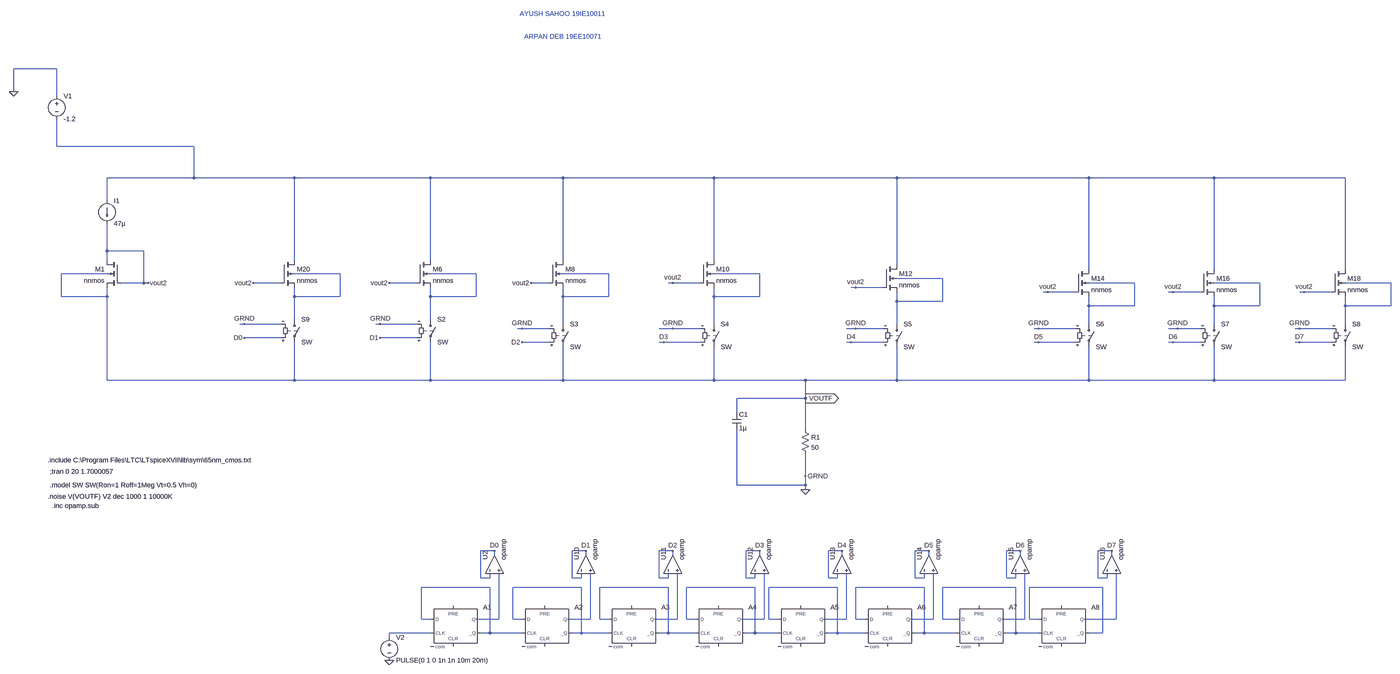
[diagram p0: schematic SIMPLE DAC.asc, whole sheet]
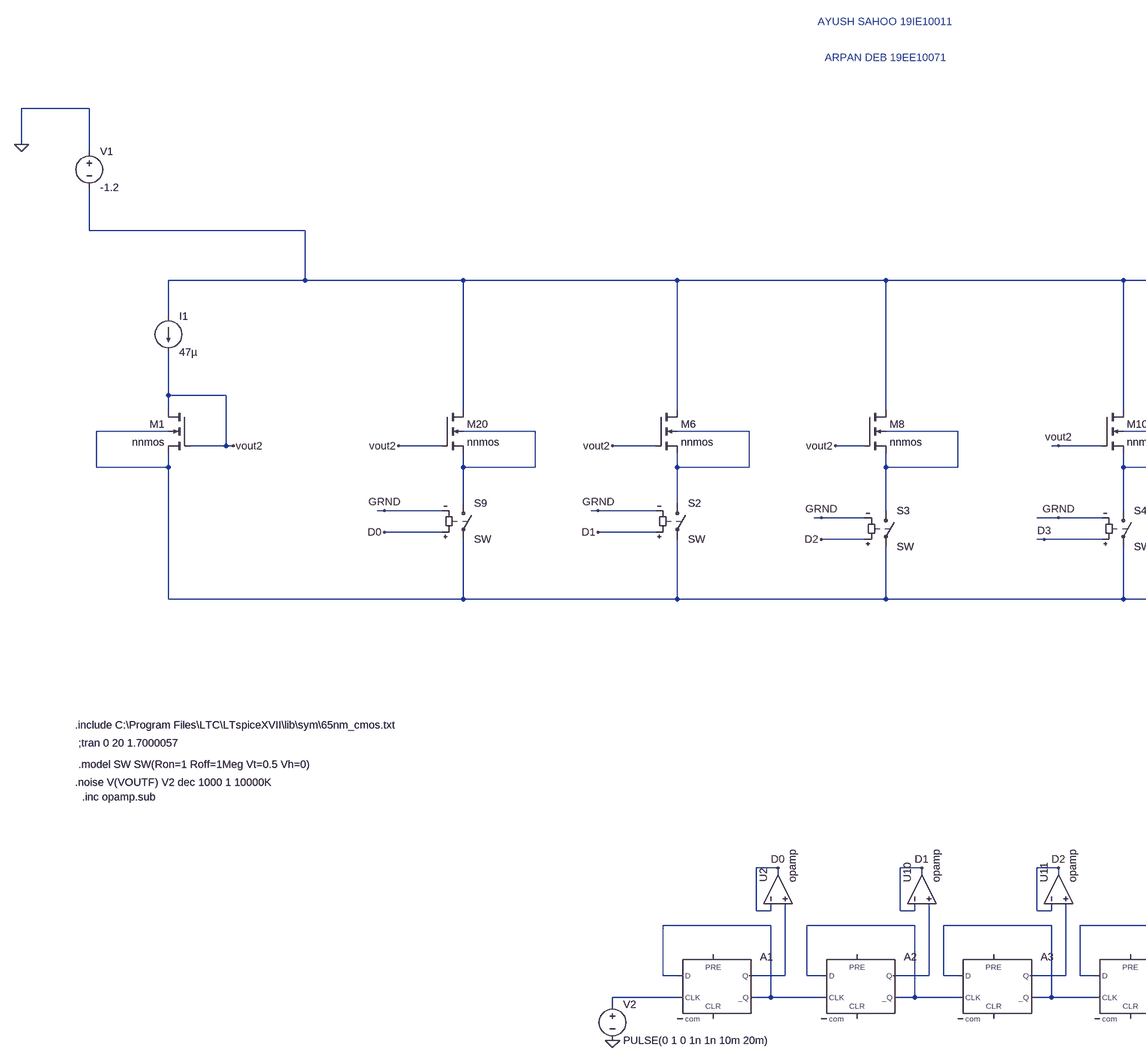
[diagram p1: schematic SIMPLE DAC.asc, part, row 1 of 1, column 1 of 2]
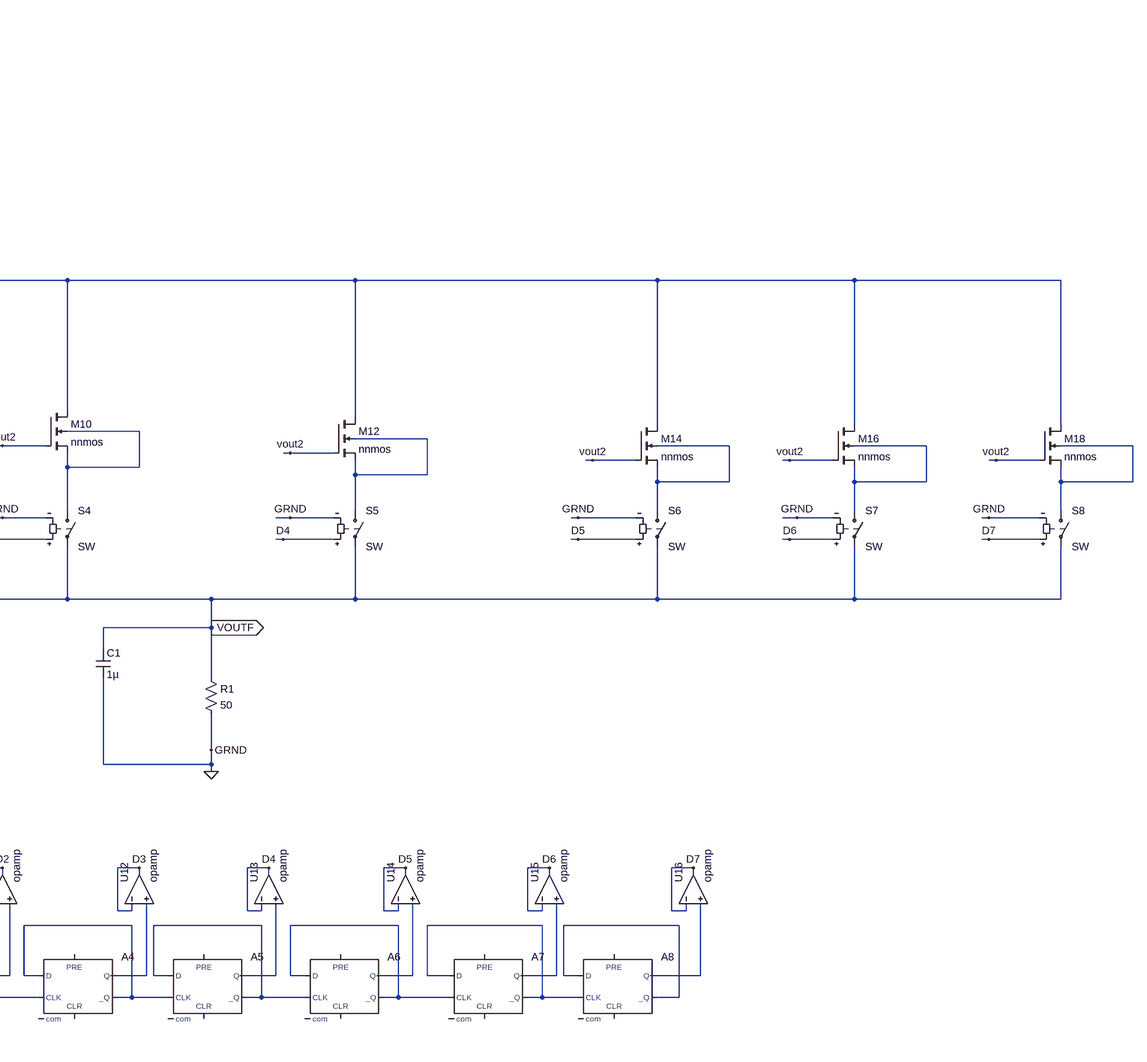
[diagram p2: schematic SIMPLE DAC.asc, part, row 1 of 1, column 2 of 2]
SIMPLE DAC.asc, the LTspice schematic file:
Version 4
SHEET 1 3556 3252
WIRE -1632 432 -2016 432
WIRE -2016 512 -2016 432
WIRE -1632 528 -1632 432
WIRE -1632 704 -1632 608
WIRE -1152 704 -1632 704
WIRE -1152 1168 -1152 704
WIRE -1152 1168 -1456 1168
WIRE -800 1168 -1152 1168
WIRE -256 1168 -800 1168
WIRE 208 1168 -256 1168
WIRE 736 1168 208 1168
WIRE 1376 1168 736 1168
WIRE 2048 1168 1376 1168
WIRE 2768 1168 2048 1168
WIRE 3392 1168 2768 1168
WIRE -1456 1248 -1456 1168
WIRE -1456 1424 -1456 1328
WIRE -1328 1424 -1456 1424
WIRE -1456 1456 -1456 1424
WIRE -800 1456 -800 1168
WIRE -256 1456 -256 1168
WIRE 208 1456 208 1168
WIRE 736 1456 736 1168
WIRE 1376 1472 1376 1168
WIRE 2048 1488 2048 1168
WIRE 2768 1488 2768 1168
WIRE 3392 1488 3392 1168
WIRE -1456 1504 -1616 1504
WIRE -640 1504 -800 1504
WIRE -96 1504 -256 1504
WIRE 368 1504 208 1504
WIRE 896 1504 736 1504
WIRE 1536 1520 1376 1520
WIRE -1328 1536 -1328 1424
WIRE -1328 1536 -1408 1536
WIRE -1312 1536 -1328 1536
WIRE -848 1536 -944 1536
WIRE -304 1536 -400 1536
WIRE 160 1536 96 1536
WIRE 592 1536 576 1536
WIRE 688 1536 592 1536
WIRE 2208 1536 2048 1536
WIRE 2928 1536 2768 1536
WIRE 3552 1536 3392 1536
WIRE 1232 1552 1216 1552
WIRE 1328 1552 1232 1552
WIRE 1904 1568 1888 1568
WIRE 2000 1568 1904 1568
WIRE 2624 1568 2608 1568
WIRE 2720 1568 2624 1568
WIRE 3248 1568 3232 1568
WIRE 3344 1568 3248 1568
WIRE -1616 1584 -1616 1504
WIRE -1456 1584 -1456 1552
WIRE -1456 1584 -1616 1584
WIRE -800 1584 -800 1552
WIRE -640 1584 -640 1504
WIRE -640 1584 -800 1584
WIRE -256 1584 -256 1552
WIRE -96 1584 -96 1504
WIRE -96 1584 -256 1584
WIRE 208 1584 208 1552
WIRE 368 1584 368 1504
WIRE 368 1584 208 1584
WIRE 736 1584 736 1552
WIRE 896 1584 896 1504
WIRE 896 1584 736 1584
WIRE 1376 1600 1376 1568
WIRE 1536 1600 1536 1520
WIRE 1536 1600 1376 1600
WIRE 2048 1616 2048 1584
WIRE 2208 1616 2208 1536
WIRE 2208 1616 2048 1616
WIRE 2768 1616 2768 1584
WIRE 2928 1616 2928 1536
WIRE 2928 1616 2768 1616
WIRE 3392 1616 3392 1584
WIRE 3552 1616 3552 1536
WIRE 3552 1616 3392 1616
WIRE -800 1664 -800 1584
WIRE -256 1664 -256 1584
WIRE -976 1680 -992 1680
WIRE -848 1680 -976 1680
WIRE -432 1680 -448 1680
WIRE -304 1680 -432 1680
WIRE 208 1680 208 1584
WIRE 736 1680 736 1584
WIRE 1376 1680 1376 1600
WIRE 2048 1680 2048 1616
WIRE 2768 1680 2768 1616
WIRE 3392 1680 3392 1616
WIRE 64 1696 48 1696
WIRE 160 1696 64 1696
WIRE 592 1696 544 1696
WIRE 688 1696 592 1696
WIRE 1232 1696 1200 1696
WIRE 1328 1696 1232 1696
WIRE 1872 1696 1856 1696
WIRE 2000 1696 1872 1696
WIRE 2640 1696 2608 1696
WIRE 2720 1696 2640 1696
WIRE 3232 1696 3216 1696
WIRE 3344 1696 3232 1696
WIRE -848 1728 -976 1728
WIRE -304 1728 -432 1728
WIRE 160 1744 64 1744
WIRE 560 1744 544 1744
WIRE 688 1744 560 1744
WIRE 1216 1744 1200 1744
WIRE 1328 1744 1216 1744
WIRE 1872 1744 1856 1744
WIRE 2000 1744 1872 1744
WIRE 2624 1744 2608 1744
WIRE 2720 1744 2624 1744
WIRE 3232 1744 3216 1744
WIRE 3344 1744 3232 1744
WIRE -1456 1920 -1456 1584
WIRE -800 1920 -800 1744
WIRE -800 1920 -1456 1920
WIRE -256 1920 -256 1744
WIRE -256 1920 -800 1920
WIRE 208 1920 208 1760
WIRE 208 1920 -256 1920
WIRE 736 1920 736 1760
WIRE 736 1920 208 1920
WIRE 1056 1920 736 1920
WIRE 1376 1920 1376 1760
WIRE 1376 1920 1056 1920
WIRE 2048 1920 2048 1760
WIRE 2048 1920 1376 1920
WIRE 2768 1920 2768 1760
WIRE 2768 1920 2048 1920
WIRE 3392 1920 3392 1760
WIRE 3392 1920 2768 1920
WIRE 1056 1984 1056 1920
WIRE 1056 1984 816 1984
WIRE 816 2032 816 1984
WIRE 1056 2096 1056 1984
WIRE 1056 2256 1056 2176
WIRE 816 2288 816 2096
WIRE 1056 2288 1056 2256
WIRE 1056 2288 816 2288
WIRE 1056 2304 1056 2288
WIRE -32 2768 -80 2768
WIRE 288 2768 240 2768
WIRE 592 2768 544 2768
WIRE 896 2768 848 2768
WIRE 1184 2768 1136 2768
WIRE 1488 2768 1440 2768
WIRE 1808 2768 1760 2768
WIRE 2128 2768 2080 2768
WIRE -32 2784 -32 2768
WIRE 288 2784 288 2768
WIRE 592 2784 592 2768
WIRE 896 2784 896 2768
WIRE 1184 2784 1184 2768
WIRE 1488 2784 1488 2768
WIRE 1808 2784 1808 2768
WIRE 2128 2784 2128 2768
WIRE -80 2864 -80 2768
WIRE -48 2864 -48 2848
WIRE -48 2864 -80 2864
WIRE 240 2864 240 2768
WIRE 272 2864 272 2848
WIRE 272 2864 240 2864
WIRE 544 2864 544 2768
WIRE 576 2864 576 2848
WIRE 576 2864 544 2864
WIRE 848 2864 848 2768
WIRE 880 2864 880 2848
WIRE 880 2864 848 2864
WIRE 1136 2864 1136 2768
WIRE 1168 2864 1168 2848
WIRE 1168 2864 1136 2864
WIRE 1440 2864 1440 2768
WIRE 1472 2864 1472 2848
WIRE 1472 2864 1440 2864
WIRE 1760 2864 1760 2768
WIRE 1792 2864 1792 2848
WIRE 1792 2864 1760 2864
WIRE 2080 2864 2080 2768
WIRE 2112 2864 2112 2848
WIRE 2112 2864 2080 2864
WIRE -48 2896 -288 2896
WIRE 272 2896 32 2896
WIRE 576 2896 336 2896
WIRE 880 2896 640 2896
WIRE 1168 2896 928 2896
WIRE 1472 2896 1232 2896
WIRE 1792 2896 1536 2896
WIRE 2096 2896 1840 2896
WIRE -288 3008 -288 2896
WIRE -256 3008 -288 3008
WIRE -16 3008 -16 2848
WIRE -16 3008 -96 3008
WIRE 32 3008 32 2896
WIRE 64 3008 32 3008
WIRE 304 3008 304 2848
WIRE 304 3008 224 3008
WIRE 336 3008 336 2896
WIRE 368 3008 336 3008
WIRE 608 3008 608 2848
WIRE 608 3008 528 3008
WIRE 640 3008 640 2896
WIRE 672 3008 640 3008
WIRE 912 3008 912 2848
WIRE 912 3008 832 3008
WIRE 928 3008 928 2896
WIRE 960 3008 928 3008
WIRE 1200 3008 1200 2848
WIRE 1200 3008 1120 3008
WIRE 1232 3008 1232 2896
WIRE 1264 3008 1232 3008
WIRE 1504 3008 1504 2848
WIRE 1504 3008 1424 3008
WIRE 1536 3008 1536 2896
WIRE 1584 3008 1536 3008
WIRE 1824 3008 1824 2848
WIRE 1824 3008 1744 3008
WIRE 1840 3008 1840 2896
WIRE 1872 3008 1840 3008
WIRE 2144 3008 2144 2848
WIRE 2144 3008 2032 3008
WIRE -256 3056 -400 3056
WIRE -48 3056 -48 2896
WIRE -48 3056 -80 3056
WIRE 64 3056 -48 3056
WIRE 272 3056 272 2896
WIRE 272 3056 240 3056
WIRE 368 3056 272 3056
WIRE 576 3056 576 2896
WIRE 576 3056 544 3056
WIRE 672 3056 576 3056
WIRE 880 3056 880 2896
WIRE 880 3056 848 3056
WIRE 960 3056 880 3056
WIRE 1168 3056 1168 2896
WIRE 1168 3056 1136 3056
WIRE 1264 3056 1168 3056
WIRE 1472 3056 1472 2896
WIRE 1472 3056 1440 3056
WIRE 1584 3056 1472 3056
WIRE 1792 3056 1792 2896
WIRE 1792 3056 1760 3056
WIRE 1872 3056 1792 3056
WIRE 2096 3056 2096 2896
WIRE 2096 3056 2048 3056
WIRE -400 3072 -400 3056
FLAG -2016 512 0
FLAG 96 1536 vout2
FLAG 592 1536 vout2
FLAG -400 1536 vout2
FLAG 1232 1552 vout2
FLAG 1904 1568 vout2
FLAG 2624 1568 vout2
FLAG 3248 1568 vout2
FLAG 1056 2304 0
FLAG -432 1728 D1
FLAG 64 1744 D2
FLAG 560 1744 D3
FLAG 1216 1744 D4
FLAG 1872 1744 D5
FLAG 2624 1744 D6
FLAG 3232 1744 D7
FLAG 1056 2256 GRND
FLAG -432 1680 GRND
FLAG 64 1696 GRND
FLAG 592 1696 GRND
FLAG 1232 1696 GRND
FLAG 1872 1696 GRND
FLAG 2640 1696 GRND
FLAG 3232 1696 GRND
FLAG -944 1536 vout2
FLAG -976 1728 D0
FLAG -976 1680 GRND
FLAG -32 2768 D0
FLAG 288 2768 D1
FLAG 592 2768 D2
FLAG 896 2768 D3
FLAG 1184 2768 D4
FLAG 1488 2768 D5
FLAG 1808 2768 D6
FLAG 2128 2768 D7
FLAG -400 3152 0
FLAG -1312 1536 vout2
FLAG 1056 1984 VOUTF
IOPIN 1056 1984 Out
SYMBOL voltage -1632 512 R0
WINDOW 123 0 0 Left 0
WINDOW 39 0 0 Left 0
SYMATTR InstName V1
SYMATTR Value -1.2
SYMBOL nmos4 -304 1456 R0
SYMATTR InstName M6
SYMATTR Value nnmos
SYMATTR Value2 l=300n w=6.75u
SYMBOL nmos4 160 1456 R0
SYMATTR InstName M8
SYMATTR Value nnmos
SYMATTR Value2 l=300n w=13.5u
SYMBOL nmos4 688 1456 R0
SYMATTR InstName M10
SYMATTR Value nnmos
SYMATTR Value2 l=300n w=28u
SYMBOL nmos4 1328 1472 R0
SYMATTR InstName M12
SYMATTR Value nnmos
SYMATTR Value2 l=300n w=55u
SYMBOL nmos4 2000 1488 R0
SYMATTR InstName M14
SYMATTR Value nnmos
SYMATTR Value2 l=300n w=110u
SYMBOL nmos4 2720 1488 R0
SYMATTR InstName M16
SYMATTR Value nnmos
SYMATTR Value2 l=300n w=221u
SYMBOL nmos4 3344 1488 R0
SYMATTR InstName M18
SYMATTR Value nnmos
SYMATTR Value2 l=300n w=440u
SYMBOL sw 208 1664 R0
SYMATTR InstName S3
SYMBOL sw 736 1664 R0
SYMATTR InstName S4
SYMBOL sw 1376 1664 R0
SYMATTR InstName S5
SYMBOL sw 2048 1664 R0
SYMATTR InstName S6
SYMBOL sw 2768 1664 R0
SYMATTR InstName S7
SYMBOL sw 3392 1664 R0
SYMATTR InstName S8
SYMBOL res 1040 2080 R0
SYMATTR InstName R1
SYMATTR Value 50
SYMBOL sw -256 1648 R0
SYMATTR InstName S2
SYMBOL nmos4 -848 1456 R0
SYMATTR InstName M20
SYMATTR Value nnmos
SYMATTR Value2 l=300n w=3.4u
SYMBOL sw -800 1648 R0
SYMATTR InstName S9
SYMBOL Digital\\dflop -176 2960 R0
SYMATTR InstName A1
SYMBOL Digital\\dflop 144 2960 R0
SYMATTR InstName A2
SYMBOL Digital\\dflop 448 2960 R0
SYMATTR InstName A3
SYMBOL Digital\\dflop 752 2960 R0
SYMATTR InstName A4
SYMBOL Digital\\dflop 1040 2960 R0
SYMATTR InstName A5
SYMBOL Digital\\dflop 1344 2960 R0
SYMATTR InstName A6
SYMBOL Digital\\dflop 1664 2960 R0
SYMATTR InstName A7
SYMBOL Digital\\dflop 1952 2960 R0
SYMATTR InstName A8
SYMBOL voltage -400 3056 R0
WINDOW 123 0 0 Left 0
WINDOW 39 0 0 Left 0
SYMATTR InstName V2
SYMATTR Value PULSE(0 1 0 1n 1n 10m 20m)
SYMBOL opamp -96 2816 R270
SYMATTR InstName U2
SYMBOL opamp 224 2816 R270
SYMATTR InstName U10
SYMBOL opamp 528 2816 R270
SYMATTR InstName U11
SYMBOL opamp 832 2816 R270
SYMATTR InstName U12
SYMBOL opamp 1120 2816 R270
SYMATTR InstName U13
SYMBOL opamp 1424 2816 R270
SYMATTR InstName U14
SYMBOL opamp 1744 2816 R270
SYMATTR InstName U15
SYMBOL opamp 2064 2816 R270
SYMATTR InstName U16
SYMBOL nmos4 -1408 1456 M0
SYMATTR InstName M1
SYMATTR Value nnmos
SYMATTR Value2 l=300n w=3.4u
SYMBOL current -1456 1248 R0
WINDOW 123 0 0 Left 0
WINDOW 39 0 0 Left 0
SYMATTR InstName I1
SYMATTR Value 47µ
SYMBOL cap 800 2032 R0
SYMATTR InstName C1
SYMATTR Value 1µ
TEXT -1664 2200 Left 2 !.include C:\\Program Files\\LTC\\LTspiceXVII\\lib\\sym\\65nm_cmos.txt
TEXT -1656 2240 Left 2 !;tran 0 20 1.7000057
TEXT 56 0 Left 2 ;AYUSH SAHOO 19IE10011
TEXT 72 80 Left 2 ;ARPAN DEB 19EE10071
TEXT -1656 2288 Left 2 !.model SW SW(Ron=1 Roff=1Meg Vt=0.5 Vh=0)
TEXT -1648 2360 Left 2 !.inc opamp.sub
TEXT -1664 2328 Left 2 !.noise V(VOUTF) V2 dec 1000 1 10000K

The netlist it stands for:
* SIMPLE DAC.asc
V1 0 N001 -1.2
M6 N001 vout2 N003 N003 nnmos l=300n w=6.75u
M8 N001 vout2 N004 N004 nnmos l=300n w=13.5u
M10 N001 vout2 N005 N005 nnmos l=300n w=28u
M12 N001 vout2 N006 N006 nnmos l=300n w=55u
M14 N001 vout2 N007 N007 nnmos l=300n w=110u
M16 N001 vout2 N008 N008 nnmos l=300n w=221u
M18 N001 vout2 N009 N009 nnmos l=300n w=440u
S3 N004 VOUTF D2 0 SW
S4 N005 VOUTF D3 0 SW
S5 N006 VOUTF D4 0 SW
S6 N007 VOUTF D5 0 SW
S7 N008 VOUTF D6 0 SW
S8 N009 VOUTF D7 0 SW
R1 VOUTF 0 50
S2 N003 VOUTF D1 0 SW
M20 N001 vout2 N002 N002 nnmos l=300n w=3.4u
S9 N002 VOUTF D0 0 SW
A1 N010 0 N026 0 0 N010 N018 0 DFLOP
A2 N011 0 N010 0 0 N011 N019 0 DFLOP
A3 N012 0 N011 0 0 N012 N020 0 DFLOP
A4 N013 0 N012 0 0 N013 N021 0 DFLOP
A5 N014 0 N013 0 0 N014 N022 0 DFLOP
A6 N015 0 N014 0 0 N015 N023 0 DFLOP
A7 N016 0 N015 0 0 N016 N024 0 DFLOP
A8 N017 0 N016 0 0 N017 N025 0 DFLOP
V2 N026 0 PULSE(0 1 0 1n 1n 10m 20m)
XU2 D0 N018 D0 opamp Aol=100K GBW=10Meg  ; pins invin noninvin out
XU10 D1 N019 D1 opamp Aol=100K GBW=10Meg  ; pins invin noninvin out
XU11 D2 N020 D2 opamp Aol=100K GBW=10Meg  ; pins invin noninvin out
XU12 D3 N021 D3 opamp Aol=100K GBW=10Meg  ; pins invin noninvin out
XU13 D4 N022 D4 opamp Aol=100K GBW=10Meg  ; pins invin noninvin out
XU14 D5 N023 D5 opamp Aol=100K GBW=10Meg  ; pins invin noninvin out
XU15 D6 N024 D6 opamp Aol=100K GBW=10Meg  ; pins invin noninvin out
XU16 D7 N025 D7 opamp Aol=100K GBW=10Meg  ; pins invin noninvin out
M1 vout2 vout2 VOUTF VOUTF nnmos l=300n w=3.4u
I1 N001 vout2 47µ
C1 VOUTF 0 1µ
.model NMOS NMOS
.model PMOS PMOS
.lib standard.mos
.include C:\Program Files\LTC\LTspiceXVII\lib\sym\65nm_cmos.txt
;tran 0 20 1.7000057
* AYUSH SAHOO 19IE10011
* ARPAN DEB 19EE10071
.model SW SW(Ron=1 Roff=1Meg Vt=0.5 Vh=0)
.inc opamp.sub
.noise V(VOUTF) V2 dec 1000 1 10000K
.backanno
.end